# Altium schematic sheet mcu_power_supply.SchDoc
size A; SheetNumber: 4; SheetTotal: 4
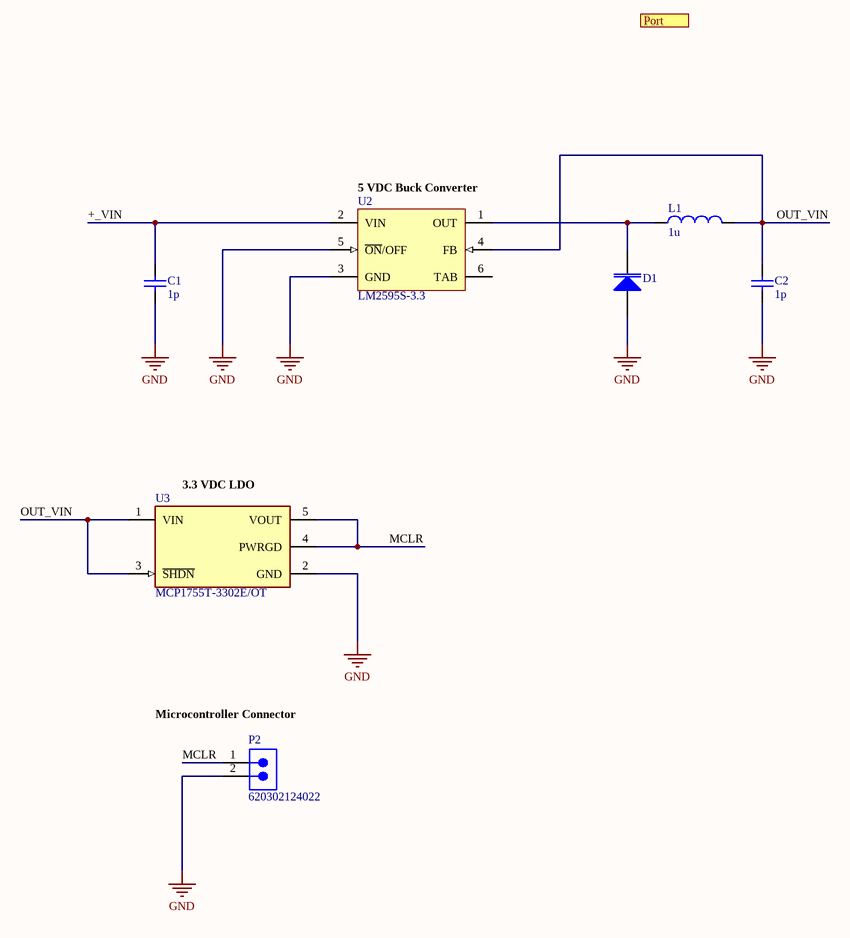
[diagram p0: mcu_power_supply.SchDoc]

## Parts
C1  value 1p  (hidden comment: Capacitor)
C2  value 1p  (hidden comment: Capacitor)
D1  Varactor  (value not drawn)
L1  value 1u  (hidden comment: Inductor)
P2  620302124022  [620302124022]
U2  LM2595S-3.3  [KTT0005B_L]
U3  MCP1755T-3302E/OT  [FP-C04-091-OT-MFG]

## Ports
Port

## Nets
GND: C1.1 C2.1 D1.3(A) P2.2 U2.3(GND) U2.5(~{ON}/OFF) U3.2(GND)
+_VIN: C1.2 U2.2(VIN)
MCLR: P2.1 U3.4(PWRGD) U3.5(VOUT)
OUT_VIN: C2.2 L1.2 U2.4(FB) U3.1(VIN) U3.3(~{SHDN})
NetD1_1: D1.1(K) L1.1 U2.1(OUT)

Not connected (* = marked no-connect by the designer): U2 6(TAB)

## Notes on the sheet
- (near U2) 5 VDC Buck Converter
- (near U3) 3.3 VDC LDO
- (near P2) Microcontroller Connector

## Library data of the parts
C1 C2 = Capacitor: SimulationGenericComponent: True
D1 = Varactor: AF: 1; BV: 0; BV_MAX: 1e99; EG: 1.11; FC: 0.5; IBV: 0.001; IS: 1e-14; MJSW: 0.33; NTUN: 30; TNOM: 27; XTI: 3; SimulationGenericComponent: True; CJO: 0; CJP: 0; CTA: 0; CTP: 0; FCS: 0.5; FV_MAX: 1e99; IKF: 0; IKR: 0; ISR: 1e-14; JSW: 0; JTUN: 0; JTUNSW: 0; KEG: 1; KF: 0; LEVEL: 1; N: 1; NBV: 1; NR: 1; NS: 1; PHP: 1; RS: 0; TCV: 0; TLEV: 0; TLEVC: 0; TM1: 0; TM2: 0; TPB: 0; TPHP: 0; TRS: 0; TRS2: 0; TT: 0; TTT1: 0; TTT2: 0; VJ: 1; XTITUN: 3
L1 = Inductor: SimulationGenericComponent: True
P2 = CMP-1502-00660-2: NexarPartId: 18818242; Insulation: Insulated; Connector Type: Male Pin; Pitch: 2mm; Insulation Resistance: 1GΩ; Gender: Male; Voltage Rating: 125V; Number of Positions: 2; Contact Resistance: 20mΩ; Operating Supply Voltage: 100V; Current Rating: 2A; Contact Material: Copper; Number of Rows: 1; Flammability Rating: UL94 V-0; Housing Material: Nylon; Lead Pitch: 2mm; Orientation: Vertical; Max Operating Temperature: 85°C; Termination: SMD/SMT; REACH SVHC: Unknown; Contact Mating Length: 3.5052mm; RoHS: Compliant; Packaging: Tape and Reel; Number of Contacts: 2; Height: 6.6mm; Mount: Surface Mount; Number of Pins: 2; Contact Gender: Male; Min Operating Temperature: -40°C; Length: 5mm; Width: 7.9mm; Contact Plating: Tin; Color: Beige, White
U2 = CMP-0069-00223-3: SIMPLE SWITCHER® Power Converter 150 KHz 1A Step-Down Voltage Regulator, 5-pin TO-263; Manufacturer: Texas Instruments; PowerWise: N; PackageTopMarking: NSUZXYTTE#*LM2595S*-3.3 P+; RoHS: N; ComponentLink1URL: http://www.ti.com/general/docs/lit/getliterature.tsp?genericPartNumber=LM2595&fileType=pdf; PackageDescription: TO-263, Molded, .400 x .390 x .180in, 5 Lead, .067in Pitch, Surface Mount; CompType: Switcher; PackageReference: KTT0005B; ComponentLink1Description: Datasheet URL; PinCount: 5; Code_JEDEC: MO-169-AB
U3 = CMP-06324-000083-1: IC REG LINEAR 3.3V 300MA SOT23-5; Output Voltage Accuracy: 2%; Nominal Supply Current: 68uA; Number of Regulators: 1; Quiescent Current: 100uA; Power Supply Rejection Ratio (PSRR): 80dB; Min Input Voltage: 3.6V; Polarity: Positive; Max Input Voltage: 16V; Output Type: Fixed; Dropout Voltage: 300mV; Series: -; Packaging: Tape and Reel; Max Operating Temperature: 125°C; Max Output Current: 300mA; Output Voltage: 3.3V; Nominal Output Voltage: 3.3V; Lead Free: Lead Free; Package Quantity: 3000; Mount: Surface Mount; Tolerance: 2%; REACH SVHC: No SVHC; Accuracy: 2%; Supply Current: 68uA; RoHS Compliant: Yes; Radiation Hardening: No; Number of Outputs: 1; Output Current: 300mA; Case/Package: SOT-23-5; Number of Pins: 5; Min Operating Temperature: -40°C